# EAGLE design p2-evalboard-v1.0.0 (EAGLE 9.6.2)
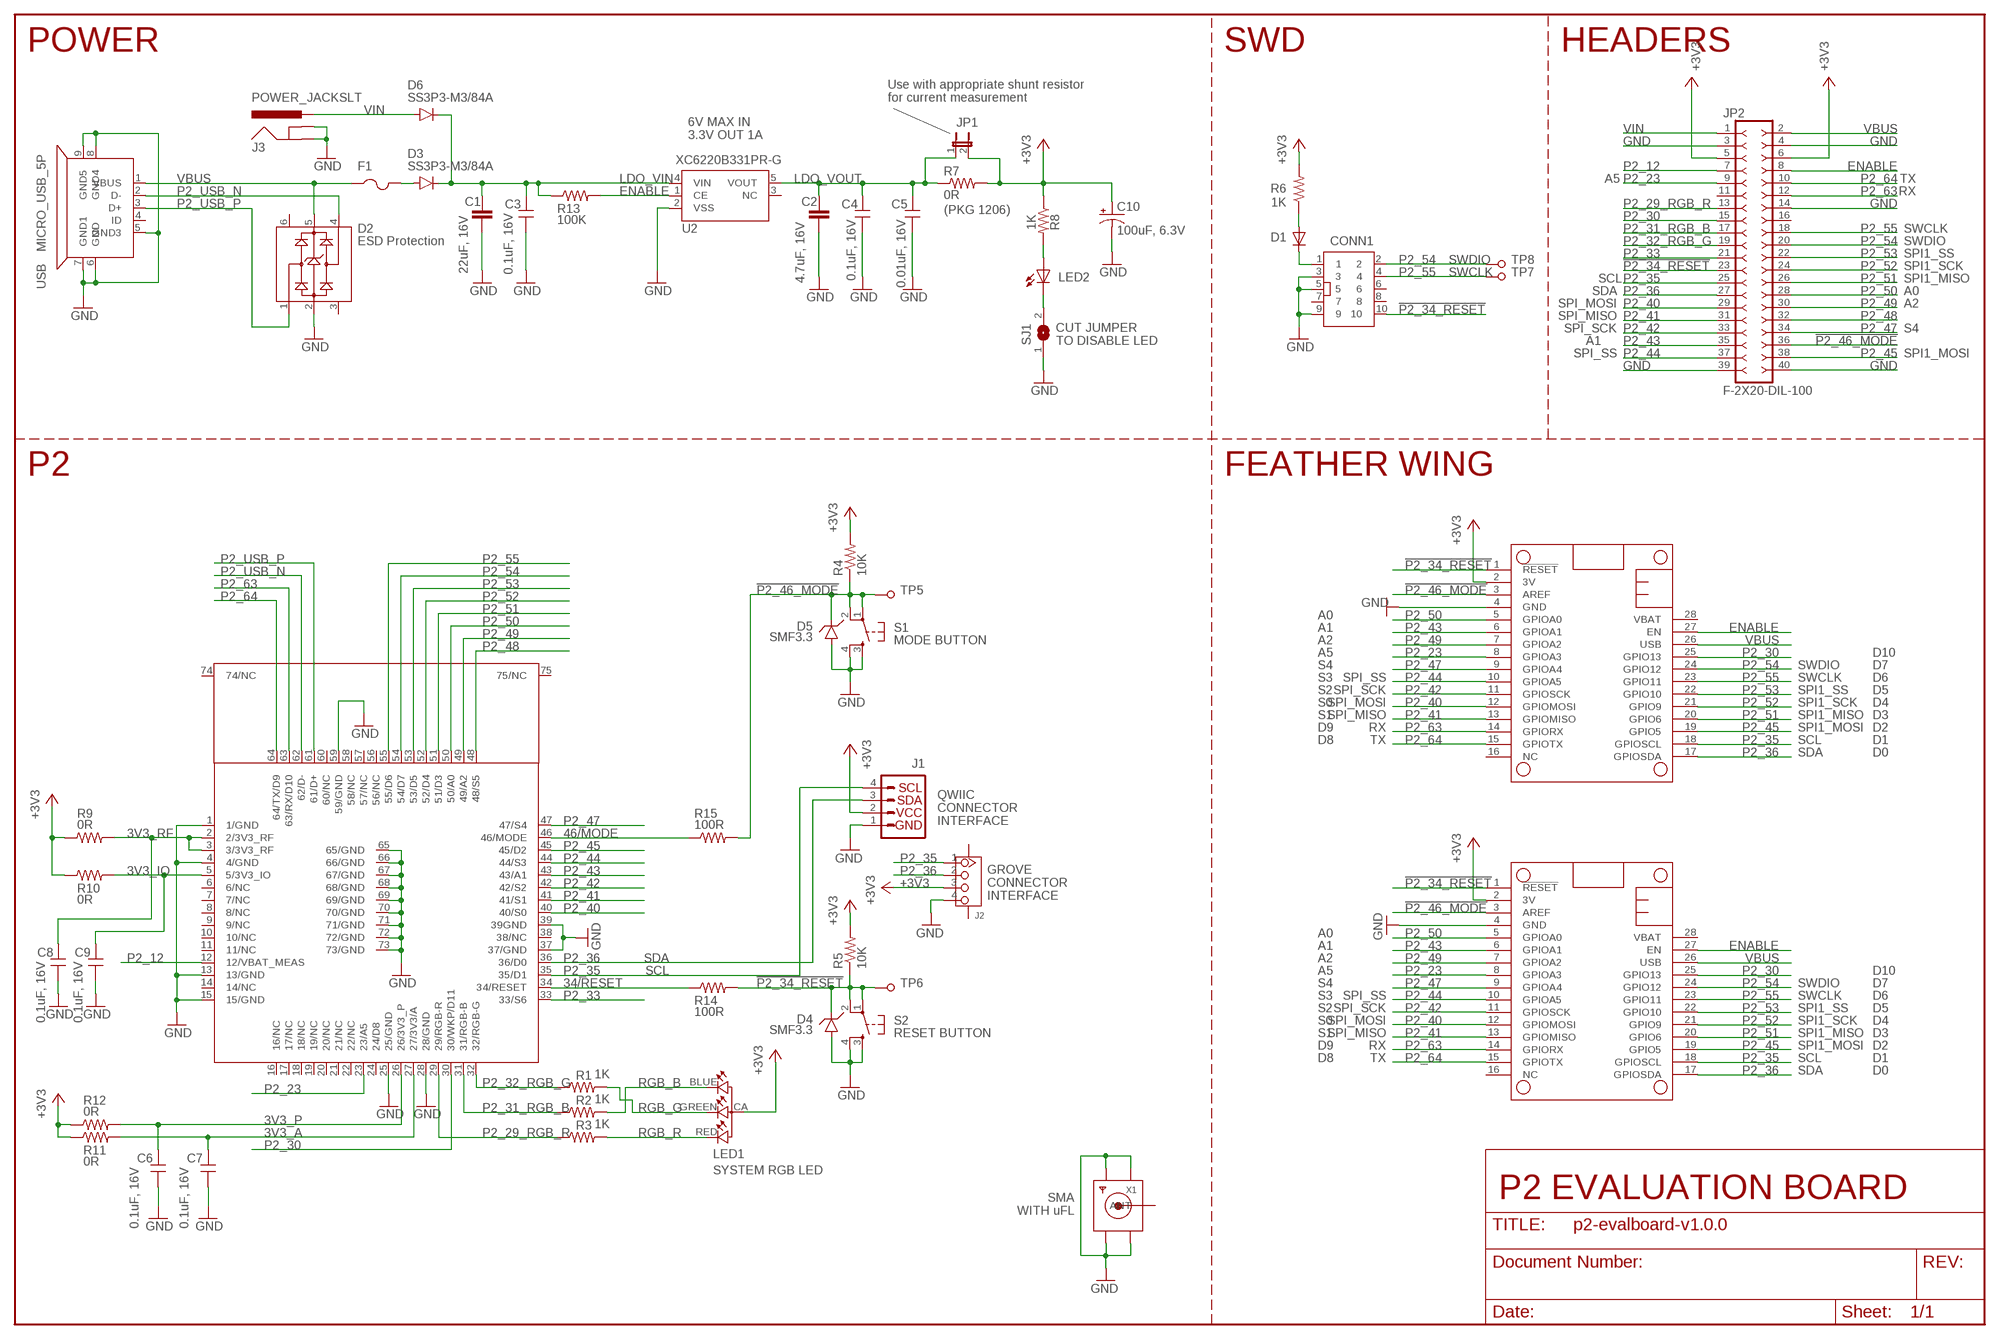
[diagram p0: schematic, sheet 1]

## Parts
C1  22uF, 16V  C-EUC0805  [C0805]
C2  4.7uF, 16V  C-EUC0805  [C0805]
C3  0.1uF, 16V  CAP_0.1UF_16V_0603  [C0603_P]
C4  0.1uF, 16V  CAP_0.1UF_16V_0603  [C0603_P]
C5  0.01uF, 16V  CAP_0.01UF_25V_0603  [C0603_P]
C6  0.1uF, 16V  CAP_0.1UF_16V_0603  [C0603_P]
C7  0.1uF, 16V  CAP_0.1UF_16V_0603  [C0603_P]
C8  0.1uF, 16V  CAP_0.1UF_16V_0603  [C0603_P]
C9  0.1uF, 16V  CAP_0.1UF_16V_0603  [C0603_P]
C10  100uF, 6.3V  CPOL-USC  [PANASONIC_C]
CONN1  CONN5X2  [CONN5X2_1.27]
D1  DIODESOD-323F  [SOD-323F]
D2  MAX3207EAUT+T  [SOT23-6]
D3  SS3P3-M3/84A  DIODE  [DIODE-DO-220AA(SMP)]
D4  SMF3.3  TVS-DIODE-SOD123FL  [SOD-123FL]
D5  SMF3.3  TVS-DIODE-SOD123FL  [SOD-123FL]
D6  SS3P3-M3/84A  DIODE  [DIODE-DO-220AA(SMP)]
F1  PTCFUSE-1206  [R1206]
J1  QWIIC_CONNECTORJS-1MM  [1X04_1MM_RA]
J2  4P-SMD-2.0-90D  GROVE-CONNECTOR-SMD-90D(4+2P-2.0)  [HW4-SMD-2.0-90D]
J3  POWER_JACKSLT  [POWER_JACK_SLOT]
JP1  JUMPER2  [JUMPER2]
JP2  F-2X20-DIL-100  [DIL-100-2X20]
LED1  RGB-LED-CLMVB-FKARGB  [PLCC4-2MM-RGB]
LED2  LEDCHIPLED_0603  [CHIPLED_0603]
MS1  FEATHERWING_NODIM  [FEATHERWING_DIM]
MS2  FEATHERWING_NODIM  [FEATHERWING_DIM]
R1  1K  RES_1K_0603  [R0603_P]
R2  1K  RES_1K_0603  [R0603_P]
R3  1K  RES_1K_0603  [R0603_P]
R4  10K  RES_10K_0603  [R0603_P]
R5  10K  RES_10K_0603  [R0603_P]
R6  1K  RES_1K_0603  [R0603_P]
R7  0R  R-US_R1206  [R1206]
R8  1K  RES_1K_0603  [R0603_P]
R9  0R  RES_0R_0603  [R0603_P]
R10  0R  RES_0R_0603  [R0603_P]
R11  0R  RES_0R_0603  [R0603_P]
R12  0R  RES_0R_0603  [R0603_P]
R13  100K  RES_100K_0603  [R0603_P]
R14  100R  RES_0603  [R0603_P]
R15  100R  RES_0603  [R0603_P]
S1  TAC_SWITCHSMD  [TACTILE_SWITCH_SMD]
S2  TAC_SWITCHSMD  [TACTILE_SWITCH_SMD]
SJ1  SOLDERJUMPERCLOSED  [SOLDERJUMPER_CLOSEDWIRE]
TP5  TP-1.5MM  [TP]
TP6  TP-1.5MM  [TP]
TP7  TP-1.5MM  [TP]
TP8  TP-1.5MM  [TP]
U1  P2  [TRON]
U2  XC6220B331PR-G  XC6220B331PR-GSOT-89-5_TOR-M  [SOT-89-5_TOR-M]
USB  MICRO_USB_5P  MICRO_USBMICRO_USB  [MICRO_USB]
X1  SMACONNECTOR  [SMA90_DIP]

## Nets
3V3_A: C7.2 R11.2 U1.27(27/3V3/A)
3V3_IO: C9.2 R10.2 U1.5(5/3V3_IO)
3V3_P: C6.2 R12.2 U1.26(26/3V3_P)
3V3_RF: C8.2 R9.2 U1.2(2/3V3_RF) U1.3(3/3V3_RF)
34/RESET: R14.1 U1.34(34/RESET)
46/MODE: R15.1 U1.46(46/MODE)
!P2_34_RESET: CONN1.10 D4.C JP2.23 MS1.1(!RESET) MS2.1(!RESET) R5.1 R14.2 S2.1 S2.2 TP6.TP
!P2_46_MODE: D5.C JP2.36 MS1.3(AREF) MS2.3(AREF) R4.1 R15.2 S1.1 S1.2 TP5.TP
+3V3: C10.+ J1.2(VCC) J2.3 JP1.2 JP2.5 JP2.6 LED1.CA MS1.2(3V) MS2.2(3V) R4.2 R5.2 R6.2 R7.2 R8.1 R9.1 R10.1 R11.1 R12.1
ENABLE: JP2.8 MS1.27(EN) MS2.27(EN) R13.2 U2.1(CE)
GND: C1.2 C2.2 C3.1 C4.1 C5.1 C6.1 C7.1 C8.1 C9.1 C10.- CONN1.3 CONN1.5 CONN1.9 D2.2 D4.A D5.A J1.1(GND) J2.4 J3.GND@1(GNDBREAK) J3.GND@2(GND) JP2.3 JP2.4 JP2.14 JP2.39 JP2.40 MS1.4(GND) MS2.4(GND) S1.3 S1.4 S2.3 S2.4 SJ1.1 U1.1(1/GND) U1.4(4/GND) U1.13(13/GND) U1.15(15/GND) U1.25(25/GND) U1.28(28/GND) U1.37(37/GND) U1.39(39GND) U1.59(59/GND) U1.65(65/GND) U1.66(66/GND) U1.67(67/GND) U1.68(68/GND) U1.69(69/GND) U1.70(70/GND) U1.71(71/GND) U1.72(72/GND) U1.73(73/GND) U2.2(VSS) USB.5(GND3) USB.6(GND) USB.7(GND1) USB.8(GND4) USB.9(GND5) X1.GND1 X1.GND2 X1.GND3 X1.GND4
LDO_VIN: C1.1 C3.2 D3.CATHODE D6.CATHODE R13.1 U2.4(VIN)
LDO_VOUT: C2.1 C4.2 C5.2 JP1.1 R7.1 U2.5(VOUT)
N$17: CONN1.1 D1.C
N$18: D1.A R6.1
N$28: LED2.C SJ1.2
N$29: D3.ANODE F1.2
N$31: LED2.A R8.2
P2_12: JP2.7 U1.12(12/VBAT_MEAS)
P2_23: JP2.9 MS1.8(GPIOA3) MS2.8(GPIOA3) U1.23(23/A5)
P2_29_RGB_R: JP2.13 R3.1 U1.29(29/RGB-R)
P2_30: JP2.15 MS1.25(GPIO13) MS2.25(GPIO13) U1.30(30/WKP/D11)
P2_31_RGB_B: JP2.17 R2.1 U1.31(31/RGB-B)
P2_32_RGB_G: JP2.19 R1.1 U1.32(32/RGB-G)
P2_33: JP2.21 U1.33(33/S6)
P2_35: J1.4(SCL) J2.1 JP2.25 MS1.18(GPIOSCL) MS2.18(GPIOSCL) U1.35(35/D1)
P2_36: J1.3(SDA) J2.2 JP2.27 MS1.17(GPIOSDA) MS2.17(GPIOSDA) U1.36(36/D0)
P2_40: JP2.29 MS1.12(GPIOMOSI) MS2.12(GPIOMOSI) U1.40(40/S0)
P2_41: JP2.31 MS1.13(GPIOMISO) MS2.13(GPIOMISO) U1.41(41/S1)
P2_42: JP2.33 MS1.11(GPIOSCK) MS2.11(GPIOSCK) U1.42(42/S2)
P2_43: JP2.35 MS1.6(GPIOA1) MS2.6(GPIOA1) U1.43(43/A1)
P2_44: JP2.37 MS1.10(GPIOA5) MS2.10(GPIOA5) U1.44(44/S3)
P2_45: JP2.38 MS1.19(GPIO5) MS2.19(GPIO5) U1.45(45/D2)
P2_47: JP2.34 MS1.9(GPIOA4) MS2.9(GPIOA4) U1.47(47/S4)
P2_48: JP2.32 U1.48(48/S5)
P2_49: JP2.30 MS1.7(GPIOA2) MS2.7(GPIOA2) U1.49(49/A2)
P2_50: JP2.28 MS1.5(GPIOA0) MS2.5(GPIOA0) U1.50(50/A0)
P2_51: JP2.26 MS1.20(GPIO6) MS2.20(GPIO6) U1.51(51/D3)
P2_52: JP2.24 MS1.21(GPIO9) MS2.21(GPIO9) U1.52(52/D4)
P2_53: JP2.22 MS1.22(GPIO10) MS2.22(GPIO10) U1.53(53/D5)
P2_54: CONN1.2 JP2.20 MS1.24(GPIO12) MS2.24(GPIO12) TP8.TP U1.54(54/D7)
P2_55: CONN1.4 JP2.18 MS1.23(GPIO11) MS2.23(GPIO11) TP7.TP U1.55(55/D6)
P2_63: JP2.12 MS1.14(GPIORX) MS2.14(GPIORX) U1.63(63/RX/D10)
P2_64: JP2.10 MS1.15(GPIOTX) MS2.15(GPIOTX) U1.64(64/TX/D9)
P2_USB_N [diff pair]: D2.4 U1.62(62/D-) USB.2(D-)
P2_USB_P [diff pair]: D2.1 U1.61(61/D+) USB.3(D+)
RGB_B: LED1.BLUE R2.2
RGB_G: LED1.GREEN R1.2
RGB_R: LED1.RED R3.2
VBUS: D2.5 F1.1 JP2.2 MS1.26(USB) MS2.26(USB) USB.1(VBUS)
VIN: D6.ANODE J3.PWR JP2.1
Unconnected: CONN1.6 CONN1.7 CONN1.8 D2.3 D2.6 J2.SS1 J2.SS2 JP2.11 JP2.16 MS1.16(NC) MS1.28(VBAT) MS2.16(NC) MS2.28(VBAT) U1.6(6/NC) U1.7(7/NC) U1.8(8/NC) U1.9(9/NC) U1.10(10/NC) U1.11(11/NC) U1.14(14/NC) U1.16(16/NC) U1.17(17/NC) U1.18(18/NC) U1.19(19/NC) U1.20(20/NC) U1.21(21/NC) U1.22(22/NC) U1.24(24/D8) U1.38(38/NC) U1.56(56/NC) U1.57(57/NC) U1.58(58/NC) U1.60(60/NC) U1.74(74/NC) U1.75(75/NC) U2.3(NC) USB.4(ID) X1.ANTENNA(ANT)

## Notes on the sheet
- POWER | SWD | HEADERS
- Use with appropriate shunt resistor 
  for current measurement
- 6V MAX IN
  3.3V OUT 1A
- A5 | TX
- RX
- (PKG 1206)
- SWCLK
- ESD Protection | SWDIO
- SPI1_SS
- SWDIO
- SPI1_SCK
- SWCLK
- SCL | SPI1_MISO
- SDA | A0
- SPI_MOSI | A2
- SPI_MISO
- SPI_SCK | S4
- CUT JUMPER 
  TO DISABLE LED
- A1
- SPI_SS | SPI1_MOSI
- P2 | FEATHER WING
- A0
- A1
- MODE BUTTON | A2
- A5 | D10
- S4 | SWDIO | D7
- S3 | SPI_SS | SWCLK | D6
- S2 | SPI_SCK | SPI1_SS | D5
- S0 | SPI_MOSI | SPI1_SCK | D4
- S1 | SPI_MISO | SPI1_MISO | D3
- D9 | RX | SPI1_MOSI | D2
- D8 | TX | SCL | D1
- SDA | D0
- QWIIC
  CONNECTOR
  INTERFACE
- GROVE
  CONNECTOR
  INTERFACE
- A0
- A1
- SDA | A2
- SCL | A5 | D10
- S4 | SWDIO | D7
- S3 | SPI_SS | SWCLK | D6
- S2 | SPI_SCK | SPI1_SS | D5
- S0 | SPI_MOSI | SPI1_SCK | D4
- RESET BUTTON | S1 | SPI_MISO | SPI1_MISO | D3
- D9 | RX | SPI1_MOSI | D2
- D8 | TX | SCL | D1
- SDA | D0
- SYSTEM RGB LED
- SMA
  WITH uFL
- P2 EVALUATION BOARD

## Library data of the parts
C1 C2 = rcl:C-EU: CAPACITOR, European symbol; SPICEPREFIX: C
C3 C4 C6-C9 = particle-studios:CAP_: Particle Capacitors; DESP: CAP CER 0.1UF 16V X7R 0603; MFG: FENGHUA; MPN: 0603B104K160NT; PPN: PT-200082
C5 = particle-studios:CAP_: Particle Capacitors; DESP: CAP CER 0.01UF 16V X7R 0603; MFG: YAGEO; MPN: CC0603KRX7R9BB103; PPN: PT-200456
C10 = rcl:CPOL-US: POLARIZED CAPACITOR, American symbol; SPICEPREFIX: C
CONN1 = particle-studios:CONN5X2: 5x2 pin JTAG connector for Particle mesh dev kits
D1 = particle-studios:DIODE: Diode SMADIODE - SMA Surface Mount Package 20V 1A Schottky Diode Digikey: 641-1014-6-ND DO-1N4148 - Through Hole Small Current Diode SOD-123 20V 1 A (.5mV Vf) Schottky Diode - Digikey: MBRX120TPMSCT-ND SOD-323 10V 570mA (.38mV Vf, 3ns) Schottky Diode - Digikey: ZLLS410CT-ND SOD-523 30V 30mA Schottky Diode (RB751S-40TE61) - Digikey: RB751S-40TE61CT-ND SOT23-R/W - SOT23 Package (R = Solder Paste/Reflow Ovens, W = Hand-Soldering) BAT54Film 40V 300mA - Digikey: 497-7162-1-ND
D2 = particle-studios:MAX3207; DESP: TVS DIODE SOT23-6; MFG: MAXIM; MPN: MAX3207EAUT+T; PPN: PC-201321
D3 D6 = Particle:DIODE
D4 D5 = particle-studios:TVS-DIODE-SOD123
F1 = adafruit:PTCFUSE: PTC fuses, resettable thermistors
J1 = SparkFun-Connectors:QWIIC_CONNECTOR: SparkFun I2C Standard Qwiic Connector An SMD 1mm pitch JST connector makes it easy and quick (get it? Qwiic?) to connect I2C devices to each other. The Qwiic system <http://www.sparkfun.com/qwiic> enables fast and solderless connection between popular platforms and various sensors and actuators. We carry 200mm <https://www.sparkfun.com/products/14204>, 100mm <https://www.sparkfun.com/products/14205>, 50mm <https://www.sparkfun.com/products/14206>, and breadboard friendly <https://www.sparkfun.com/products/14207> Qwiic cables. We also offer 10 pcs strips <https://www.sparkfun.com/products/14323> the SMD connectors.
J2 = Seeed-Connector:GROVE-CONNECTOR-SMD-90D(4+2P-2.0): 320110032
J3 = Particle:POWER_JACK: Power Jack This is the standard 5.5mm barrel jack for power. The PTH is the most common, proven, reliable, footprint. The Slot footprint only works if the mill layer is transmitted to the PCB fab house so be warned. Spark Fun Electronics SKU : PRT-00119 SMT: CONN-08106 Mating wall wart : TOL-00298 (and others)
JP1 = microbuilder:JUMPER2: JUMPER - 2 Pins
JP2 = con-headers-jp:F-2X20-: FEMALE HEADER
LED1 = particle-studios:RGB-LED-CLMVB-FKA: CREE CLMVB-FKA RGB LED 2mm x 2mm
LED2 = adafruit:LED: LED OSRAM: - CHIPLED LG R971, LG N971, LY N971, LG Q971, LY Q971, LO R971, LY R971 LH N974, LH R974 LS Q976, LO Q976, LY Q976 LO Q996 - Hyper CHIPLED LW Q18S LB Q993, LB Q99A, LB R99A - SideLED LS A670, LO A670, LY A670, LG A670, LP A670 LB A673, LV A673, LT A673, LW A673 LH A674 LY A675 LS A676, LA A676, LO A676, LY A676, LW A676 LS A679, LY A679, LG A679 - Hyper Micro SIDELED® LS Y876, LA Y876, LO Y876, LY Y876 LT Y87S - SmartLED LW L88C, LW L88S LB L89C, LB L89S, LG L890 LS L89K, LO L89K, LY L89K LS L896, LA L896, LO L896, LY L896 - TOPLED LS T670, LO T670, LY T670, LG T670, LP T670 LSG T670, LSP T670, LSY T670, LOP T670, LYG T670 LG T671, LOG T671, LSG T671 LB T673, LV T673, LT T673, LW T673 LH T674 LS T676, LA T676, LO T676, LY T676, LB T676, LH T676, LSB T676, LW T676 LB T67C, LV T67C, LT T67C, LS T67K, LO T67K, LY T67K, LW E67C LS E67B, LA E67B, LO E67B, LY E67B, LB E67C, LV E67C, LT E67C LW T67C LS T679, LY T679, LG T679 LS T770, LO T770, LY T770, LG T770, LP T770 LB T773, LV T773, LT T773, LW T773 LH T774 LS E675, LA E675, LY E675, LS T675 LS T776, LA T776, LO T776, LY T776, LB T776 LHGB T686 LT T68C, LB T68C - Hyper Mini TOPLED® LB M676 - Mini TOPLED Santana® LG M470 LS M47K, LO M47K, LY M47K Source: http://www.osram.convergy.de/
MS1 MS2 = adafruit:FEATHERWING
R1-R3 R6 R8 = particle-studios:RES_: Particle Resistors; DESP: RES SMD 1K OHM 1% 1/10W 0603; MFG: FENGHUA; MPN: RC-03K102FT; PPN: PT-200135
R4 R5 = particle-studios:RES_: Particle Resistors; DESP: RES SMD 10K OHM 1% 1/10W 0603; MFG: YAGEO; MPN: RC0603FR-0710KL; PPN: PT-200477
R7 = rcl:R-US_: RESISTOR, American symbol; SPICEPREFIX: R
R9-R12 = particle-studios:RES_: Particle Resistors; DESP: RES SMD 0R OHM JUMPER 1/10W 0603; MFG: UMC; MPN: RC0603JR-070RL; PPN: PT-200478
R13 = particle-studios:RES_: Particle Resistors; DESP: RES SMD 100K OHM 1% 1/10W 0603
R14 R15 = particle-studios:RES_: Particle Resistors
S1 S2 = particle-studios:TAC_SWITCH: SMD Tactiile Switch
SJ1 = microbuilder:SOLDERJUMPER: SMD Solder JUMPER Solder the two pads together to create a connection, or remove the solder to break it. REFLOW - Use this footprint for solder paste and reflow ovens. WAVE - Use this footprint for hand-soldering (larger pads). CLOSED - Has a trace between the two pads to ensure it is closed by default. The trace needs to be cut to disable the jumper, and can be closed again by creating a solder bridge between the two pads.
TP5-TP8 = particle-studios:TP-1.5MM
U1 = particle-studios:P2
U2 = particle-studios:XC6220B331PR-G; COPYRIGHT: Copyright (C) 2022 Ultra Librarian. All rights reserved.; DIGI-KEY_PART_NUMBER_1: 893-1128-1-ND; DIGI-KEY_PART_NUMBER_2: 893-1128-2-ND; DIGI-KEY_PART_NUMBER_3: 893-1128-2-NDL; DIGI-KEY_PART_NUMBER_4: 893-1128-6-ND; MANUFACTURER_PART_NUMBER: XC6220B331PR-G; MFR_NAME: Torex Semiconductor
USB = RedBear:MICRO_USB: Micro-USB
X1 = adafruit:SMACONNECTOR: SMA Connector 90° DIP SMA Connector, 50 Ohm (4UConnector: 07259)

## Net classes
1 diff pair: width 0.483 mm, drill 0.3 mm, clearance 0.152 mm

## Board
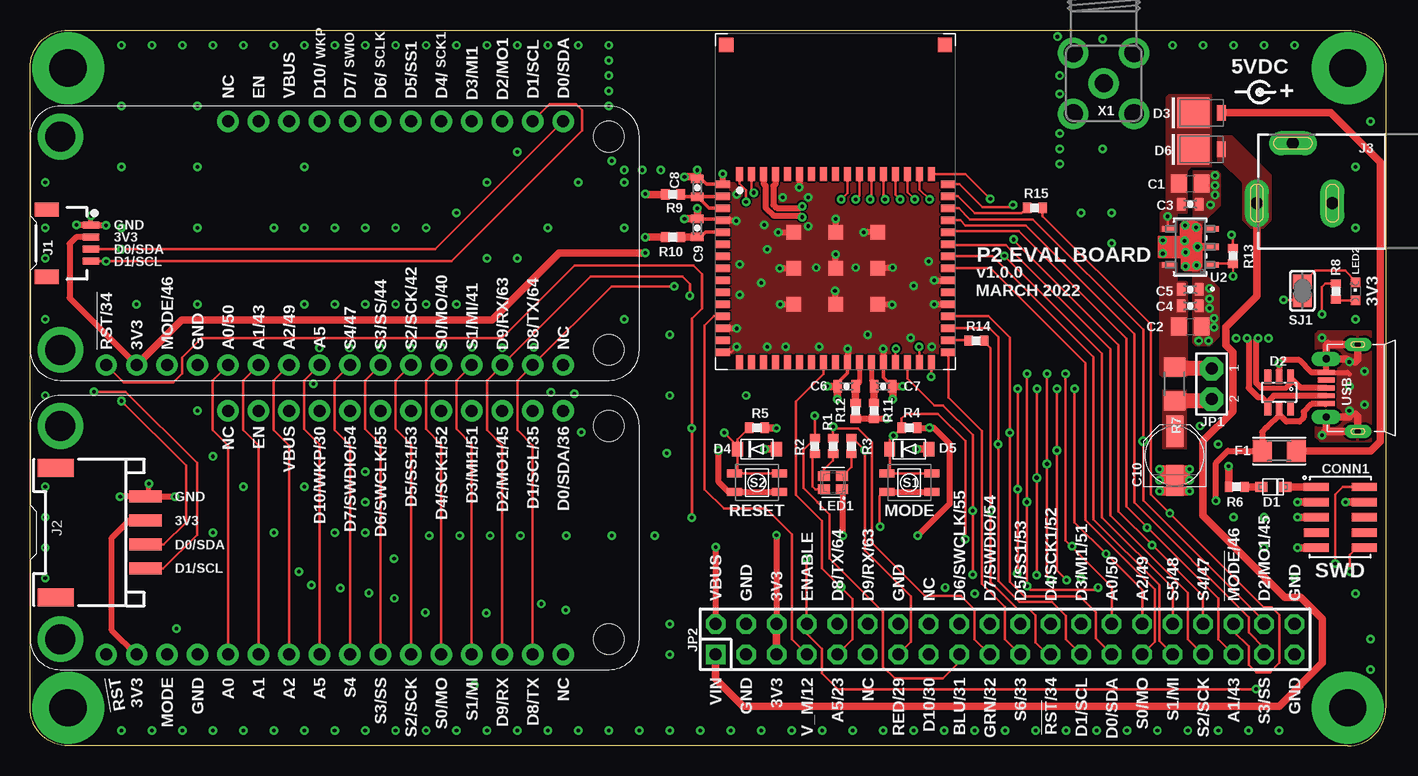
[diagram p1: board, top side]
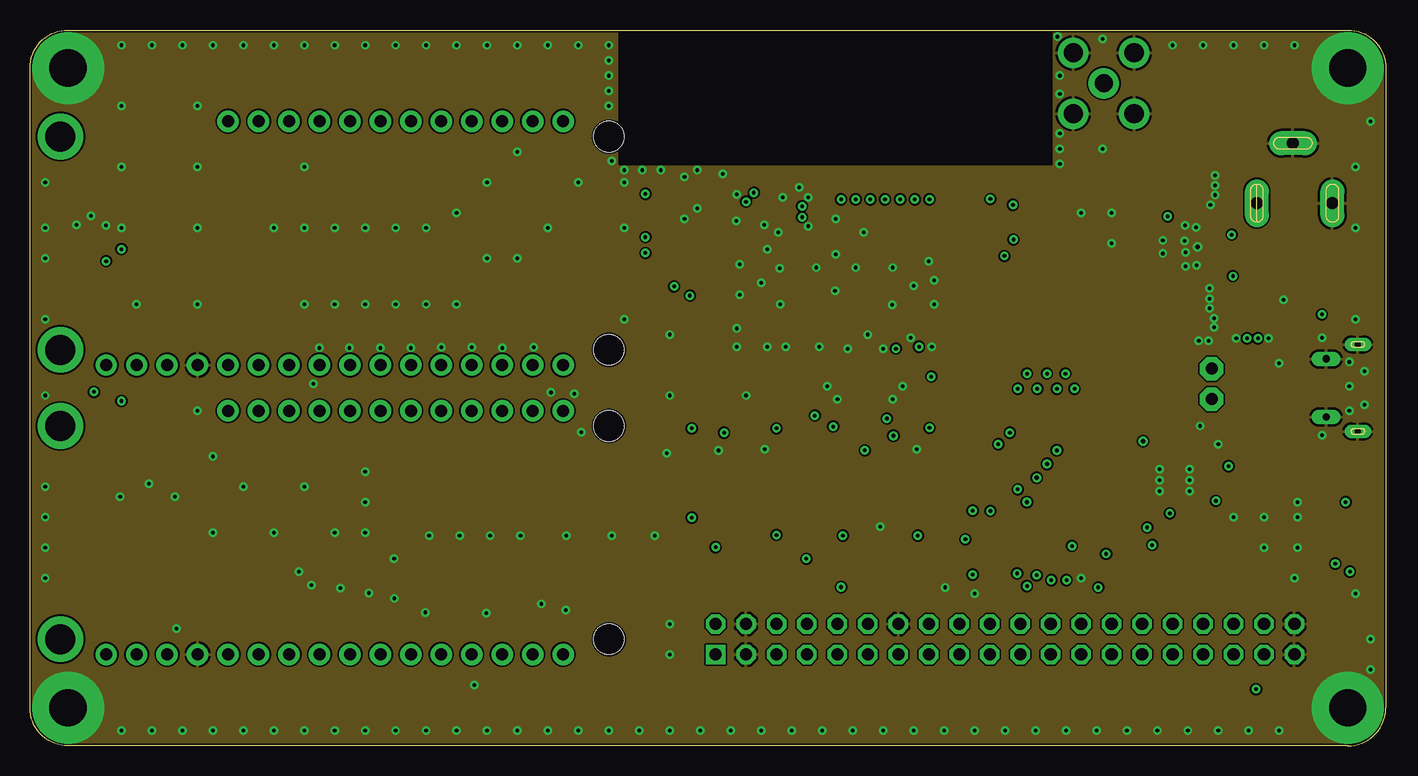
[diagram p2: board, inner layer Route2]
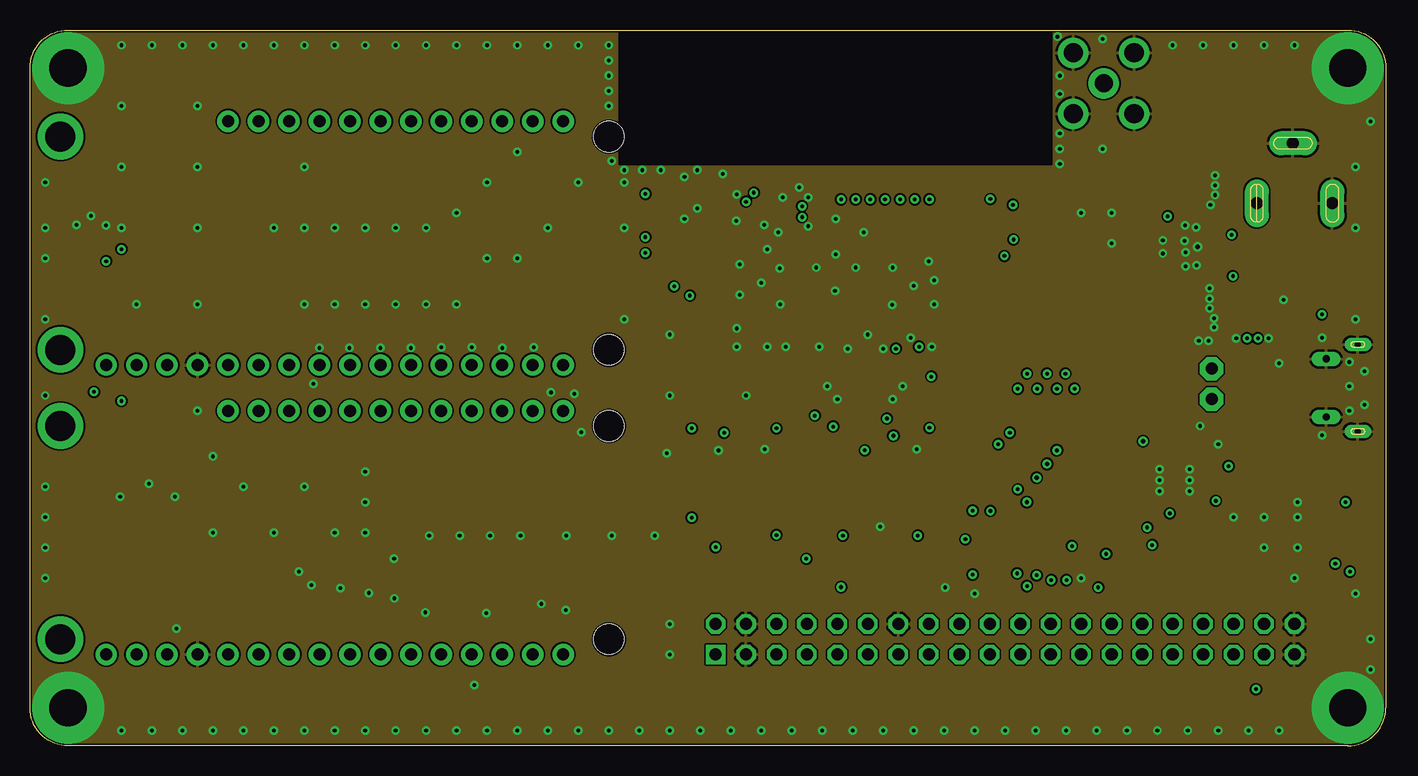
[diagram p3: board, inner layer Route15]
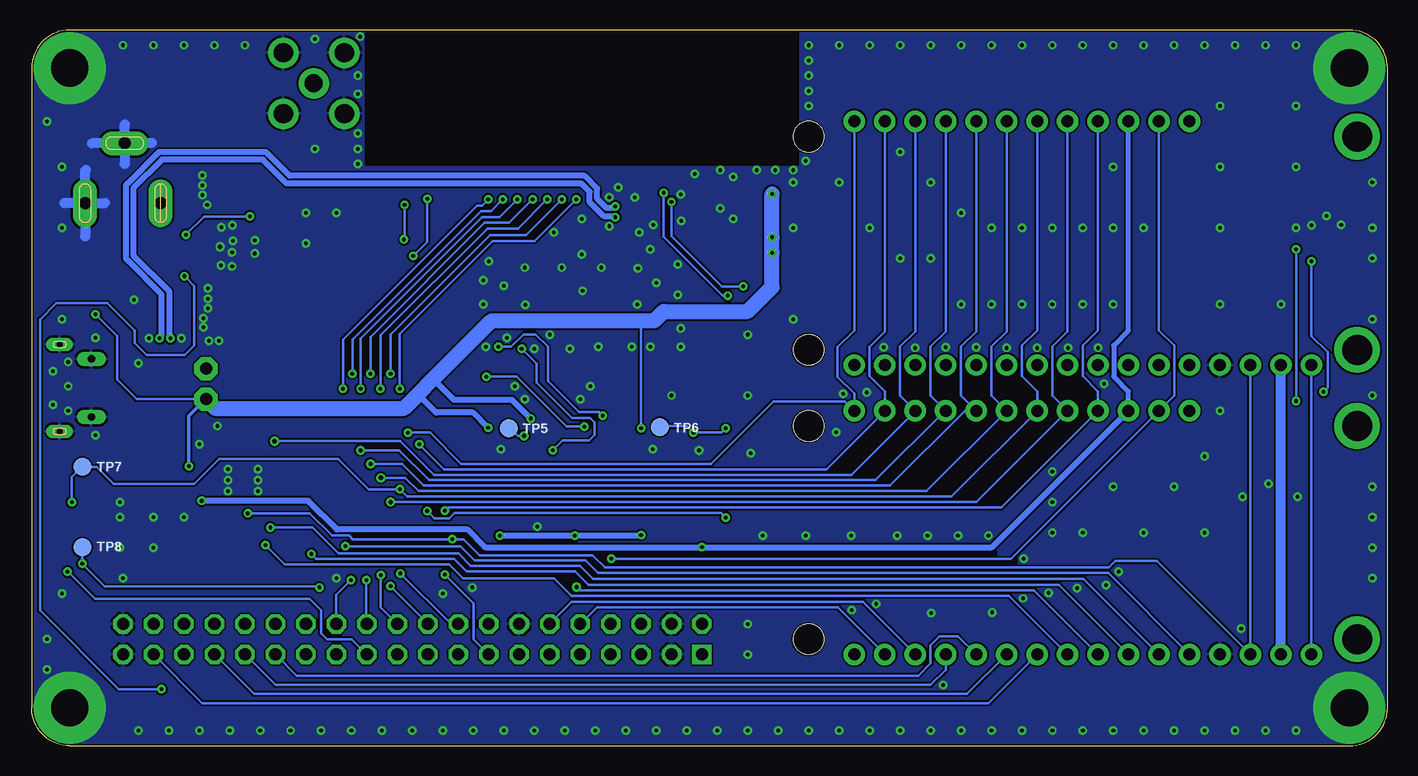
[diagram p4: board, bottom side, seen from below]

Size 113.03 x 59.69 mm. Coordinates in mm from the lower left corner, seen from the top.
Outline: 0,3.17 0,56.52 arc-90 3.17,59.69 109.86,59.69 arc-90 113.03,56.52 113.03,3.17 arc-90 109.86,0 3.17,0 arc-90 0,3.17
Copper layers (1+2*15+16): Top 0.018mm / dielectric 0.195mm / Route2 0.035mm / dielectric 1.1mm / Route15 0.035mm / dielectric 0.195mm / Bottom 0.018mm
Design rules "particle-4layer": minimum track width 6mil, minimum drill 0.3mm, track to track 6mil, track to pad 6mil, pad to pad 6mil, via to via 6mil, smd to smd 0mil, copper to edge 6mil, drill to drill 6mil, minimum pad ring 12mil, minimum via ring 8mil, stop-mask expansion 0mil, vias tented up to drill 20mil, thermal gap 8mil
bRestrict: 2 lines

### Footprints (pad centres in the part's own frame; a part is rotated, then mirrored left to right if it is on the bottom)
C0805 = smd 1.3 x 1.5: 1 -0.95,0; 2 0.95,0
C0603_P = smd 0.711 x 1.041: 1 -0.749,0; 2 0.749,0
PANASONIC_C = smd 2.6 x 1.4: + 2.05,0; - -2.05,0
CONN5X2_1.27 = smd 0.7 x 2.1: 1 -2.54,-2; 2 -2.54,2; 3 -1.27,-2; 4 -1.27,2; 5 0,-2; 6 0,2; 7 1.27,-2; 8 1.27,2; 9 2.54,-2; 10 2.54,2
SOD-323F = smd 1 x 0.8: A -1,0; C 1,0
SOT23-6 = smd 0.55 x 1.2: 1 -0.95,-1.3; 2 0,-1.3; 3 0.95,-1.3; 4 0.95,1.3; 5 0,1.3; 6 -0.95,1.3
DIODE-DO-220AA(SMP) = smd 0.762 x 1.27: ANODE 2.349,0 | smd 2.667 x 2.54: CATHODE 0,0
SOD-123FL = smd 0.91 x 1.22: A 1.637,0; C -1.637,0
R1206 = smd 1.6 x 1.803: 1 -1.422,0; 2 1.422,0
1X04_1MM_RA = smd 0.6 x 1.35: 1 -1.5,0; 2 -0.5,0; 3 0.5,0; 4 1.5,0 | smd 1.2 x 2: NC1 2.8,-3.675; NC2 -2.8,-3.675
HW4-SMD-2.0-90D = smd 1.01 x 2.74: 1 -3,-0.1; 2 -1,-0.1; 3 1,-0.1; 4 3,-0.1 | smd 1.5 x 3: SS1 -5.4,7.4; SS2 5.4,7.4
POWER_JACK_SLOT = drill 1 pad 2 long: GND@1 2.58,7.5; GND@2 7.58,10.8; PWR 2.58,13.8
JUMPER2 = drill 1 pad 1.93 octagon: 1 2.54,0; 2 0,0
DIL-100-2X20 = drill 1.016 square: 1 -24.13,-1.27 | drill 1.016 octagon: 2 -24.13,1.27; 3 -21.59,-1.27; 4 -21.59,1.27; 5 -19.05,-1.27; 6 -19.05,1.27; 7 -16.51,-1.27; 8 -16.51,1.27; 9 -13.97,-1.27; 10 -13.97,1.27; 11 -11.43,-1.27; 12 -11.43,1.27; 13 -8.89,-1.27; 14 -8.89,1.27; 15 -6.35,-1.27; 16 -6.35,1.27; 17 -3.81,-1.27; 18 -3.81,1.27; 19 -1.27,-1.27; 20 -1.27,1.27; 21 1.27,-1.27; 22 1.27,1.27; 23 3.81,-1.27; 24 3.81,1.27; 25 6.35,-1.27; 26 6.35,1.27; 27 8.89,-1.27; 28 8.89,1.27; 29 11.43,-1.27; 30 11.43,1.27; 31 13.97,-1.27; 32 13.97,1.27; 33 16.51,-1.27; 34 16.51,1.27; 35 19.05,-1.27; 36 19.05,1.27; 37 21.59,-1.27; 38 21.59,1.27; 39 24.13,-1.27; 40 24.13,1.27
PLCC4-2MM-RGB = smd 1 x 0.8: BLUE -0.75,-0.55; CA 0.75,-0.55; GREEN -0.75,0.55; RED 0.75,0.55
CHIPLED_0603 = smd 0.8 x 0.8: A 0,-0.75; C 0,0.75
FEATHERWING_DIM = drill 1 pad 1.778: 1 6.35,1.27; 2 8.89,1.27; 3 11.43,1.27; 4 13.97,1.27; 5 16.51,1.27; 6 19.05,1.27; 7 21.59,1.27; 8 24.13,1.27; 9 26.67,1.27; 10 29.21,1.27; 11 31.75,1.27; 12 34.29,1.27; 13 36.83,1.27; 14 39.37,1.27; 15 41.91,1.27; 16 44.45,1.27; 17 44.45,21.59; 18 41.91,21.59; 19 39.37,21.59; 20 36.83,21.59; 21 34.29,21.59; 22 31.75,21.59; 23 29.21,21.59; 24 26.67,21.59; 25 24.13,21.59; 26 21.59,21.59; 27 19.05,21.59; 28 16.51,21.59 | drill 2.5 pad 3.81: P$1 2.54,20.32; P$2 2.54,2.54 | hole 2.54: 48.26,20.32; 48.26,2.54
R0603_P = smd 0.7 x 0.85: 1 -0.65,0; 2 0.65,0
TACTILE_SWITCH_SMD = smd 1.25 x 0.65: 1 -1.875,0.775; 2 1.875,0.775; 3 -1.875,-0.775; 4 1.875,-0.775
SOLDERJUMPER_CLOSEDWIRE = smd 1.168 x 1.6: 1 -0.762,0; 2 0.762,0 | smd 0.635 x 0.203: WIRE 0,0
TP = smd 1.5 x 1.5: TP 0,0
TRON = smd 1.2 x 0.6: 1 0.6,15.45; 2 0.6,14.45; 3 0.6,13.45; 4 0.6,12.45; 5 0.6,11.45; 6 0.6,10.45; 7 0.6,9.45; 8 0.6,8.45; 9 0.6,7.45; 10 0.6,6.45; 11 0.6,5.45; 12 0.6,4.45; 13 0.6,3.45; 14 0.6,2.45; 15 0.6,1.45; 33 19.4,1.45; 34 19.4,2.45; 35 19.4,3.45; 36 19.4,4.45; 37 19.4,5.45; 38 19.4,6.45; 39 19.4,7.45; 40 19.4,8.45; 41 19.4,9.45; 42 19.4,10.45; 43 19.4,11.45; 44 19.4,12.45; 45 19.4,13.45; 46 19.4,14.45; 47 19.4,15.45 | smd 0.6 x 1.2: 16 2,0.6; 17 3,0.6; 18 4,0.6; 19 5,0.6; 20 6,0.6; 21 7,0.6; 22 8,0.6; 23 9,0.6; 24 10,0.6; 25 11,0.6; 26 12,0.6; 27 13,0.6; 28 14,0.6; 29 15,0.6; 30 16,0.6; 31 17,0.6; 32 18,0.6; 48 18,16.3; 49 17,16.3; 50 16,16.3; 51 15,16.3; 52 14,16.3; 53 13,16.3; 54 12,16.3; 55 11,16.3; 56 10,16.3; 57 9,16.3; 58 8,16.3; 59 7,16.3; 60 6,16.3; 61 5,16.3; 62 4,16.3; 63 3,16.3; 64 2,16.3 | smd 1.2 x 1.2: 65 6.5,11.45; 66 6.5,8.45; 67 6.5,5.45; 68 10,11.45; 69 10,8.45; 70 10,5.45; 71 13.5,11.45; 72 13.5,8.45; 73 13.5,5.45; 74 19.12,27.07; 75 0.88,27.07
SOT-89-5_TOR-M = smd 0.483 x 1.118: 1 -1.5,-1.803; 3 1.5,-1.803; 4 1.5,1.803; 5 -1.5,1.803 | smd 0.533 x 1.118: 2 0,-1.803
MICRO_USB = smd 0.4 x 1.4: 1 1.3,0.1; 2 0.65,0.1; 3 0,0.1; 4 -0.65,0.1; 5 -1.3,0.1 | drill 0.6 pad 0.75 long: 6 2.425,0.1 | drill 0.5 pad 1 long: 7 3.625,2.75; 8 -3.625,2.75 | drill 0.6 pad 0.65 long: 9 -2.425,0.1
SMA90_DIP = drill 1.5 pad 2.54: ANTENNA 0,0 | drill 1.6 pad 2.54: GND1 -2.54,2.54; GND2 2.54,2.54; GND3 -2.54,-2.54; GND4 2.54,-2.54

### Placement (x,y rotation side)
C1  96.72,46.89 0 top
C2  96.72,34.95 0 top
C3  96.72,45.16 180 top
C4  96.72,36.68 180 top
C5  96.72,38.05 180 top
C6  68.07,29.97 0 top
C7  71.12,29.97 180 top
C8  55.63,46.53 270 top
C9  55.63,43.18 270 top
C10  95.43,24.19 90 top
CONN1  109.22,19.05 270 top
D1  103.63,21.59 0 top
D2  104.14,29.46 180 top
D3  96.98,52.78 0 top
D4  60.6,24.74 0 top
D5  73.3,24.74 0 top
D6  96.98,49.73 0 top
F1  104.14,24.59 0 top
J1  5.08,41.91 270 top
J2  9.53,17.78 90 top
J3  116.08,42.67 90 top
JP1  98.5,28.91 90 top
JP2  81.28,8.89 0 top
LED1  66.95,21.95 0 top
LED2  110.49,37.9 0 top
MS1  0,6.35 0 top
MS2  0,30.48 0 top
R1  66.95,24.99 270 top
R2  65.43,24.99 270 top
R3  68.48,24.99 270 top
R4  73.3,26.52 0 top
R5  60.6,26.52 0 top
R6  100.58,21.59 180 top
R7  95.4,30.18 270 top
R8  108.86,37.9 270 top
R9  53.59,45.97 0 top
R10  53.59,42.42 0 top
R11  70.36,27.94 90 top
R12  68.83,27.94 90 top
R13  100.28,40.84 270 top
R14  78.89,33.78 0 top
R15  83.77,44.86 0 top
S1  73.3,21.95 0 top
S2  60.6,21.95 0 top
SJ1  106.07,37.95 90 top
TP5  73.25,26.47 0 bottom
TP6  60.66,26.57 0 bottom
TP7  108.81,23.27 0 bottom
TP8  108.81,16.56 0 bottom
U1  57.15,31.37 0 top
U2  96.72,41.61 90 top
USB  107.95,29.84 270 top
X1  89.51,55.24 0 top

### Tracks (layer width: path | path; a pad name or v marks a point on that pad's centre or on a via)
3V3_A
  Top 0.406: U1.27 70.15,30.5 70.37,30.28 C7.2 70.36,29.96
  Top 0.61: R11.2 70.36,29.96
3V3_IO
  Top 0.305: C9.2 55.93,42.43 56.32,42.82 U1.5
  Top 0.508: C9.2 55.61,42.42
  Top 0.61: 55.61,42.42 R10.2
3V3_P
  Top 0.406: U1.26 69.15,30.3 C6.2 | R12.2 68.82,28.6
  Top 0.61: 68.82,28.6 C6.2
3V3_RF
  Top 0.305: U1.2 57.65,45.92 57.51,45.78 C8.2 | U1.3 56.59,44.82 C8.2 | C8.2 54.43,45.78 R9.2
34/RESET
  Top 0.203: U1.34 78.2,33.82 R14.1
46/MODE
  Top 0.203: U1.46 77.37,45.82 78.79,44.4 82.66,44.4 R15.1
!P2_34_RESET  (via drill 0.3)
  Top 0.203: 59.99,26.56 R5.1 58.97,25.53 58.97,25.01 | 58.97,25.01 D4.C 58.97,22.81 58.88,22.72 | S2.1 58.88,22.72 | 58.88,22.72 S2.2 | MS2.1 7.82,30.28 11.94,30.28 12.7,31.04 12.7,32.36 14.33,33.98 39.37,33.98 45.41,40.03 55.32,40.03 56.03,39.32 56.03,36.47 55.17,35.61 v55.17,26.47 v55.17,19.02 | v57.86,26.11 58.97,25.01 | CONN1.10 110.59,16.51 110.02,15.94 110.02,14.54 v110.03,14.53 | JP2.23 84.84,7.62 83.82,8.64 83.82,10.87 83.26,11.43 82.3,11.43 80.06,13.66 v80.06,19.58 80.06,33.17 79.54,33.69 R14.2
  Bottom 0.203: MS1.1 MS2.1 | v55.17,26.47 55.52,26.11 v57.86,26.11 58.42,26.67 60.55,26.67 TP6.TP | JP2.23 86.36,8.89 88.39,8.89 88.9,9.4 88.9,11.28 89.86,12.24 107.75,12.24 v110.03,14.53 | v80.06,19.58 79.43,18.95 78.23,18.95 77.78,19.41 55.55,19.41 v55.17,19.02
!P2_46_MODE  (via drill 0.3, 0.35)
  Top 0.203: S1.1 71.63,22.72 | 71.63,22.72 S1.2 | 71.63,22.72 71.67,22.76 D5.C 71.67,25.53 v71.99,25.85 R4.1 72.65,27.29 73.05,27.69 75.69,27.69 77.98,25.4 v77.98,17.22 | 100.33,10.21 JP2.36 100.33,9.55 101.6,8.28 101.6,6.76 102.21,6.15 103.38,6.15 104.14,6.91 104.14,10.92 103.53,11.53 102.87,11.53 v95.02,19.38 93.42,20.98 93.42,35.15 84.4,44.17 84.4,44.84 R15.2
  Bottom 0.203: MS2.3 MS1.3 19.23,15.42 22.68,15.42 23.24,14.86 65.23,14.86 66.26,15.89 75.68,15.89 77.01,17.22 v77.98,17.22 86.26,17.22 86.56,17.53 87.99,17.53 89.84,19.38 v95.02,19.38 | TP5.TP 73.11,26.47 72.5,25.85 v71.99,25.85
+3V3  (via drill 0.3)
  Top 0.203: 62.18,26.52 v62.23,26.47 | v99.92,23.32 99.93,23.31 | R8.1 107.99,38.55 107.7,38.25 v107.7,35.97
  Top 0.508: MS1.2 8.84,7.62 6.83,9.63 6.83,17.35 8.26,18.78 J2.3 | J1.2 3.85,42.41 3.3,41.86 3.3,37.34 MS2.2 | R12.1 R11.1 v71.44,27.29 | 51.36,45.97 v51.31,46.02 | R4.2 v74.98,26.52 75.34,26.52 76.66,25.2 76.66,20.17 v74.02,17.53 | v67.77,17.53 67.77,21.33 LED1.CA | v62.23,17.58 JP2.6
  Top 0.61: MS2.2 12.65,35.51 38.51,35.51 44.09,41.1 v51.31,41.1 | R5.2 62.18,26.52 | R9.1 51.36,45.97 | R10.1 v51.31,42.42 | 99.93,23.31 R6.2 | JP2.5 JP2.6
  Top 1.27: JP1.2 98.35,28.75 R7.2
  Bottom 0.203: v62.23,26.47 62.23,35.46 | JP1.2 104.29,28.91 105.92,30.53 105.92,34.19 v107.7,35.97
  Bottom 0.305: JP1.2 99.92,27.48 v99.92,23.32
  Bottom 0.508: v71.44,27.29 73,28.85 77.83,28.85 79.55,30.58 | v74.02,17.53 v67.77,17.53 62.28,17.53 v62.23,17.58 | v74.98,26.52 76.25,27.79 79.3,27.79 80.82,29.31
  Bottom 0.813: MS1.2 MS2.2
  Bottom 1.27: JP1.2 97.74,28.14 81.99,28.14 80.82,29.31 79.55,30.58 74.68,35.46 62.23,35.46 61.11,35.46 60.35,36.22 53.34,36.22 51.31,38.25 v51.31,41.1 v51.31,42.42 v51.31,46.02
  pour Top (no thermals): 94.39,24.79 96.42,24.79 96.42,29.62 94.39,29.62
ENABLE  (via drill 0.3)
  Top 0.152: R13.2 v100.28,39.17
  Top 0.203: v64.72,15.6 64.72,10.21 JP2.8 64.77,9.35 66.04,8.08 66.04,6.04 67.36,4.72 v102.21,4.72 | R13.2 98.61,40.19 U2.1
  Bottom 0.203: MS2.27 19.05,34.64 17.78,33.37 17.78,29.21 MS1.27 31.39,15.6 v64.72,15.6 | v102.21,4.72 105.77,4.72 112.32,11.28 112.32,35.56 110.97,36.91 106.73,36.91 104.44,34.62 104.44,33.6 103.43,32.59 100.25,32.59 99.47,33.38 99.47,38.35 v100.28,39.17
GND  (via drill 0.3, 0.35, 3.1 pad 6)
  Top 0.152: v58.93,33.27 58.47,32.82 U1.15
  Top 0.203: S2.3 58.51,21.17 | S1.3 71.17,21.17 70.81,20.81 70.81,18.34 v70.87,18.29 | SJ1.1 v104.5,37.19
  Top 0.305: C8.1 55.94,47.28 56.41,46.82 U1.1 | C9.1 57.64,43.93 U1.4 | U1.25 68.15,31.07 67.32,30.24 C6.1 | U1.28 71.15,30.69 C7.1
  Top 0.406: USB.5 109.83,31.14 109.98,30.99 | J1.1 v5.08,44.2 | J2.4 9.91,21.06 v9.91,21.84
  Top 0.508: U1.13 58.91,34.82 v58.93,34.8 | U1.4 58.85,43.82 v58.88,43.79 | U1.1 v57.75,47.69 v57.76,47.7 | v62.38,42.82 U1.65 | v62.48,39.83 U1.66 | v62.53,36.83 U1.67 | v67.11,37.95 67.11,36.86 U1.70 | U1.69 67.15,40.99 v67.16,41 | v67.16,43.94 v67.15,43.93 U1.68 | U1.71 v69.49,42.82 | v71.93,39.88 71.87,39.82 U1.72 | v71.88,36.78 70.69,36.78 U1.73 | v75.39,36.83 U1.37 | v75.39,38.81 U1.39 | v71.12,33.12 71.15,33.09 U1.28 | v68.17,33.12 68.17,31.99 U1.25 | U1.59 64.14,47.65 v64.14,46.56 | C7.1 71.93,29.91 | C6.1 67.31,29.96 | C9.1 55.61,43.94 | 55.46,47.45 C8.1 | v6.35,43.38 6.32,43.41 J1.1 3.88,43.41 v3.86,43.43 | v12.09,20.78 J2.4 v7.52,20.78 | S2.4 S2.3 58.22,21.17 57.4,21.99 v57.4,24.64 | S1.3 S1.4 | D2.2 v104.14,31.9 104.39,32.16 105.82,32.16 106.83,31.14 USB.5 USB.9
  Top 0.61: C7.1 v72.75,29.97 | 71.93,29.91 v71.93,28.91 | C6.1 v66.45,29.97 | 67.31,29.96 v67.31,28.91 | C9.1 v55.63,44.81 | 55.61,43.94 v54.56,43.94 | v54.56,47.45 55.46,47.45 | v55.63,48.01 C8.1 | D4.A v61.27,24.74 | D5.A v73.91,24.74 | CONN1.3 v105.66,20.32 | CONN1.5 v105.66,19.05 | CONN1.9 v105.66,16.51 | v96.32,41.15 96.32,41.1 97.33,40.08 | 97.38,43.28 96.27,42.16 v96.27,42.11 | U2.2 v97.33,41.6 | 110.49,32 110.7,32.21 USB.8 108.26,33.47 108.2,33.53 108.05,33.37 USB.9 109.72,32.27 v109.98,32 | 108.05,26.26 USB.6 108.06,27.43 109.98,27.43 | 108.05,26.26 107.95,26.16 | 110.49,27.69 110.7,27.48 USB.7 108.09,26.22 108.05,26.26
  Top 0.762: v94.18,23.06 v96.67,23.06 | v94.18,21.23 v96.67,21.23 | v94.18,22.15 v96.67,22.15 95.45,22.15 C10.-
  Top 0.813: v96.32,41.15 v96.32,39.98 97.23,39.98 97.33,40.08 v97.33,41.6 97.33,43.13 97.08,43.38 v96.29,43.38 96.27,43.36 v96.27,42.11
  Bottom 0.813: J3.GND@2 107.99,50.25 108,50.24 | J3.GND@2 105.26,50.27 105.26,51.82 | J3.GND@2 105.24,50.29 103.02,50.29 | J3.GND@2 105.28,48.53 105.26,48.51 | J3.GND@1 106.94,45.25 106.93,45.26 | J3.GND@1 108.58,47.94 108.51,48.01 | J3.GND@1 110.28,45.25 110.29,45.26 | J3.GND@1 108.58,42.49 108.56,42.47
  other vias: 98.7,34.9 98.35,36.47 98.35,38.15 98.35,37.29 98.7,35.66 97.43,33.78 98.4,45.11 98.81,46.74 98.81,45.92 98.81,47.55 98.25,33.78 94.44,41.05 94.44,42.16 64.87,45.75 64.87,43.33 103.25,33.99 100.56,33.99 109.98,29.97 109.98,27.94 107.7,34.04 107.7,25.91 111.25,28.45 111.25,31.24 61.21,43.43 59.18,40.13 59.18,37.59 61.47,33.27 62.99,33.27 65.79,33.27 73.41,34.04 69.85,34.29 62.74,45.72 58.93,45.97 65.53,39.88 68.83,39.88 73.66,38.35 74.93,40.39 61.47,41.4 60.96,38.61 75.18,33.27 7.62,1.27 10.16,1.27 12.7,1.27 15.24,1.27 17.78,1.27 20.32,1.27 22.86,1.27 25.4,1.27 27.94,1.27 30.48,1.27 33.02,1.27 35.56,1.27 38.1,1.27 40.64,1.27 43.18,1.27 45.72,1.27 48.26,1.27 50.8,1.27 53.34,1.27 55.88,1.27 58.42,1.27 60.96,1.27 63.5,1.27 66.04,1.27 68.58,1.27 71.12,1.27 73.66,1.27 76.2,1.27 78.74,1.27 81.28,1.27 83.82,1.27 86.36,1.27 88.9,1.27 91.44,1.27 93.98,1.27 96.52,1.27 99.06,1.27 101.6,1.27 104.14,1.27 7.62,58.42 10.16,58.42 12.7,58.42 15.24,58.42 17.78,58.42 20.32,58.42 22.86,58.42 25.4,58.42 27.94,58.42 30.48,58.42 33.02,58.42 35.56,58.42 38.1,58.42 40.64,58.42 43.18,58.42 45.72,58.42 48.26,58.42 48.26,57.15 48.26,55.88 48.26,54.61 48.26,53.34 105.41,58.42 102.87,58.42 100.33,58.42 97.79,58.42 95.25,58.42 1.27,13.97 1.27,16.51 1.27,19.05 1.27,21.59 1.27,29.21 1.27,35.56 1.27,40.64 1.27,43.18 1.27,46.99 111.76,6.35 111.76,8.89 110.49,12.7 110.49,35.56 110.49,43.18 110.49,48.26 111.76,52.07 87.63,44.45 90.17,41.91 90.17,44.45 100.33,19.05 102.87,19.05 102.87,16.51 105.41,13.97 87.63,13.97 33.27,17.53 35.81,17.53 38.35,17.53 40.89,17.53 44.7,17.53 48.51,17.53 52.07,17.53 7.62,53.34 7.62,48.26 7.62,43.18 13.97,43.18 13.97,48.26 13.97,53.34 13.97,36.83 8.89,36.83 13.97,27.94 15.24,24.13 15.24,17.78 12.19,9.78 3.17,3.17 3.17,56.52 109.86,56.52 109.86,3.17 53.34,10.16 53.34,7.62 59.69,29.21 53.34,29.21 53.34,34.29 49.53,35.56 49.53,43.18 49.53,46.99 45.72,46.99 20.32,43.18 22.86,43.18 25.4,43.18 27.94,43.18 30.48,43.18 33.02,43.18 22.86,48.26 22.86,36.83 25.4,36.83 27.94,36.83 30.48,36.83 33.02,36.83 35.56,36.83 35.56,44.45 38.1,46.99 38.1,40.64 40.64,40.64 40.64,49.53 43.18,43.18 17.78,21.59 20.32,17.78 22.86,21.59 25.4,17.78 27.94,20.32 27.94,17.78 27.94,22.86 48.51,48.77 49.53,48.01 51.05,48.01 52.58,48.01 85.85,48.51 85.85,49.78 85.85,51.05 89.41,58.93 89.41,49.78 53.09,24.38 43.43,29.46 45.97,26.16 78.74,12.7 97.54,26.67 99.06,25.15 85.85,54.36 85.85,55.88 85.65,59.13 97.21,43.23 97.26,40.08 44.65,11.33 42.62,11.84 30.38,12.29 28.24,12.75 23.47,13.41 22.43,14.53 23.62,30.18 45.36,29.36 39.37,33.17 42.01,33.22 36.83,33.22 34.29,33.22 31.75,33.17 29.21,33.17 26.62,33.17 24.13,33.17 32.97,11.13 38.05,11.07 37.03,5.08 30.35,15.62 25.88,13.16 76.3,13.21
  pour Top (no thermals): 97.18,33.32 96.93,33.58 96.93,40.49 97.74,40.49 97.74,39.57 99.11,38.2 99.11,34.09 98.35,33.32
  pour Top (no thermals): 96.98,42.72 96.98,47.96 98.96,47.96 99.21,47.7 99.21,45.06 97.74,43.59 97.74,42.72
  pour Route2 (rank 2): 0,0 0,59.69 113.03,59.69 113.03,0
  pour Route15: 0,0 0,59.69 113.03,59.69 113.03,0
  pour Bottom: 0,0 0,59.69 113.03,59.69 113.03,0
  cutout Route2: 49.15,48.46 49.15,59.69 85.17,59.69 85.17,48.46
  cutout Route15: 49.15,48.46 49.15,59.69 85.17,59.69 85.17,48.46
  cutout Bottom: 49.15,48.46 49.15,59.69 85.17,59.69 85.17,48.46
  pour Top (no thermals): 58.37,32.66 58.37,46.99 75.84,46.99 75.84,32.66
  pour Top: 111.76,34.54 111.76,25.4 107.54,25.4 107.19,25.76 107.19,34.34 107.39,34.54
  cutout Route2 (no thermals): 101.3,45.21 101.3,46.23 arc-90 102.31,47.24 arc-90 103.28,46.28 103.28,45.21 103.28,44.25 arc-90 102.26,43.23 arc-90 101.3,44.2
  cutout Route15 (no thermals): 101.3,44.2 101.3,46.23 arc-90 102.31,47.24 arc-90 103.28,46.28 103.28,44.25 arc-90 102.26,43.23 arc-90
LDO_VIN  (via drill 0.3)
  Top 0.203: U2.4 94.84,43.18 v94.84,44.15 | v100.18,42.62 100.28,42.52 R13.1
  Bottom 0.203: v94.84,44.15 98.65,44.15 v100.18,42.62
  pour Top (rank 2, no thermals): 94.18,42.88 95.66,42.88 95.66,44.4 96.47,44.4 96.47,47.96 96.82,48.31 98.5,48.31 98.5,54.31 94.95,54.31 94.69,54.05 94.69,44.91 94.18,44.4
LDO_VOUT
  Top 1.27: JP1.1 | JP1.1 95.56,31.45 R7.1
  pour Top (no thermals): 94.18,30.94 94.18,40.28 94.23,40.34 95.5,40.34 95.61,40.23 95.61,38.76 96.37,38.76 96.47,38.66 96.47,30.84 96.37,30.73 94.39,30.73
N$17
  Top 0.61: D1.C CONN1.1
N$18
  Top 0.61: R6.1 D1.A
N$28
  Top 0.203: LED2.C 110.49,38.76 109.63,39.62 107.14,39.62 106.22,38.71 SJ1.2
N$29
  Top 0.61: D3.ANODE 108.46,52.78 112.56,48.68 112.56,25.39 111.76,24.59 F1.2
N$31
  Top 0.203: LED2.A 108.96,37.15 R8.2
P2_12
  Top 0.203: JP2.7 63.5,8.89 63.5,17.63 61.34,19.79 57.83,19.79 56.24,21.39 56.24,35.05 57,35.82 U1.12
P2_23  (via drill 0.35)
  Top 0.203: U1.23 66.15,31 63.86,28.7 63.86,20.93 66.04,18.75 66.04,14.78 67.59,13.23 v67.61,13.23 68.58,12.27 68.58,8.89 JP2.9 | MS1.8 24.13,25.15 22.86,26.42 22.86,30.48 MS2.8
  Bottom 0.203: MS1.8 29.46,12.95 67.34,12.95 v67.61,13.23
P2_29_RGB_R  (via drill 0.3)
  Top 0.203: R3.1 68.59,25.64 v69.6,24.64 69.6,16.31 73.46,12.45 73.46,8.69 JP2.13 72.03,7.62 | U1.29 72.15,33.09 v72.19,33.12
  Bottom 0.203: v72.19,33.12 70.94,31.88 70.94,30.3 68,27.36 66.47,27.36 66.09,26.98 66.09,25.91 66.55,25.45 68.78,25.45 v69.6,24.64
P2_30  (via drill 0.3)
  Top 0.203: v78.59,14.28 v78.59,19.61 78.59,25.91 76.1,28.4 75.39,28.4 73.15,30.63 U1.30
  Bottom 0.203: MS2.25 24.13,34.64 25.4,33.37 25.4,30.83 24.13,29.56 MS1.25 32.21,19.86 78.33,19.86 v78.59,19.61 | JP2.15 76.2,8.89 76.2,11.89 v78.59,14.28
P2_31_RGB_B  (via drill 0.3)
  Top 0.203: JP2.17 77.47,7.01 76.1,5.64 72.08,5.64 71.12,6.6 71.12,11.18 66.65,15.65 66.65,19.3 65.63,20.32 64.47,21.49 64.47,24.68 R2.1 v65.43,27.53 | v74.12,33.27 74.15,33.24 U1.31
  Bottom 0.203: v74.12,33.27 73.05,33.27 72.03,34.29 71.02,34.29 70,33.27 70,30.43 67.41,27.84 65.73,27.84 v65.43,27.53
P2_32_RGB_G  (via drill 0.3)
  Top 0.203: JP2.19 78.74,8.89 78.74,11.38 77.62,12.5 74.62,12.5 70.21,16.92 70.21,25.3 69.04,26.47 67,26.47 66.95,26.42 R1.1 v66.95,26.62 | v75.13,30.79 75.13,31.95 U1.32
  Bottom 0.203: v75.13,30.79 72.59,30.79 68.43,26.62 v66.95,26.62
P2_33
  Top 0.203: JP2.21 81.28,8.89 81.28,11.58 79.35,13.51 79.35,26.26 76.55,29.06 U1.33
P2_35  (via drill 0.3)
  Top 0.203: JP2.25 86.36,8.89 86.36,10.82 85.19,11.99 82.5,11.99 80.72,13.77 v80.72,25.15 80.72,34.09 79.96,34.85 76.58,34.85 U1.35 | J1.4 v6.35,40.41 35.13,40.41 46.02,51.31 46.02,52.98 45.52,53.49 43.33,53.49 MS2.18 | J2.1 11.12,14.78 13.92,17.58 13.92,23.57 7.98,29.52 v5.33,29.52
  Bottom 0.203: MS2.18 41.91,34.53 43.18,33.27 43.18,30.83 41.91,29.56 MS1.18 46.79,23.06 78.64,23.06 v80.72,25.15 | v5.33,29.52 4.98,29.87 4.98,32.82 6.35,34.19 v6.35,40.41
P2_36  (via drill 0.3)
  Top 0.203: JP2.27 90.17,7.63 88.85,8.96 88.85,11.12 87.53,12.45 82.91,12.45 81.68,13.67 v81.68,26.11 81.68,34.04 79.9,35.82 U1.36 | J1.3 v7.62,41.41 33.79,41.41 MS2.17 | J2.2 11.14,16.78 13.01,18.64 13.01,23.37 v7.62,28.75
  Bottom 0.203: MS2.17 44.45,34.64 45.85,33.24 45.85,30.77 44.45,29.37 MS1.17 45.21,28.7 51.21,28.7 56.39,23.52 77.22,23.52 79.81,26.11 v81.68,26.11 | v7.62,28.75 v7.62,41.41
P2_40
  Top 0.203: JP2.29 92.75,7.62 93.78,8.65 93.78,13.05 87.99,18.84 87.99,24.64 87.99,31.9 80.07,39.82 U1.40 | MS1.12 34.29,25.15 33.02,26.42 33.02,30.48 MS2.12
  Bottom 0.203: MS1.12 35.81,9.14 37.34,9.14 38.1,8.38 38.1,6.86 39.12,5.84 90.93,5.84 JP2.29
P2_41
  Top 0.203: U1.41 80.24,40.82 88.65,32.41 88.65,24.03 88.65,18.9 94.13,13.41 94.13,8.74 JP2.31 | MS1.13 36.83,25.15 35.56,26.42 35.56,30.48 MS2.13
  Bottom 0.203: MS1.13 36.83,6.35 38.1,5.08 92.71,5.08 JP2.31
P2_42
  Top 0.203: U1.42 76.6,41.77 81.37,41.77 90.07,33.07 90.07,19.2 96.52,12.75 96.52,8.89 JP2.33 | MS1.11 31.75,25.15 30.48,26.42 30.48,30.48 MS2.11
  Bottom 0.203: MS1.11 35.05,4.32 94.49,4.32 JP2.33
P2_43  (via drill 0.3)
  Top 0.203: MS1.6 19.05,25.05 17.78,26.32 17.78,30.48 MS2.6 | JP2.35 99.06,8.89 99.06,12.29 v93.14,18.21 91.39,19.96 91.39,33.98 82.45,42.92 76.66,42.92 U1.43
  Bottom 0.203: MS1.6 25.35,13.92 66.22,13.92 67.31,15.01 76.43,15.01 77.44,16.03 87.43,16.03 89.61,18.21 v93.14,18.21
P2_44
  Top 0.203: JP2.37 102.87,8.18 101.6,9.45 101.6,10.72 92.05,20.27 92.05,34.34 83.01,43.38 77.98,43.38 77.54,43.82 U1.44 | MS1.10 29.21,25.15 27.94,26.42 27.94,30.48 MS2.10
  Bottom 0.203: MS1.10 33.27,3.56 98.81,3.56 JP2.37
P2_45  (via drill 0.35)
  Top 0.203: U1.45 77.42,44.82 78.35,43.89 83.62,43.89 92.81,34.7 92.81,25.4 | 92.81,25.4 92.81,20.47 102.87,10.41 JP2.38 | v92.79,25.4 92.81,25.4
  Bottom 0.203: MS2.19 39.37,34.54 40.64,33.27 40.64,29.21 MS1.19 44.7,22.61 79.5,22.61 82.3,25.4 v92.79,25.4
P2_47  (via drill 0.3)
  Top 0.203: MS1.9 26.67,25.05 25.4,26.32 25.4,30.48 MS2.9 | JP2.34 97.79,12.5 v93.55,16.74 90.73,19.56 90.73,33.43 81.99,42.16 v81.99,42.22 | U1.47 77.49,46.82 79.38,44.93 81.76,44.93 v81.94,45.11
  Bottom 0.203: MS1.9 31.55,12.5 68.02,12.5 69.49,13.97 77.06,13.97 78.23,15.14 91.95,15.14 v93.55,16.74 | v81.99,42.22 81.94,42.27 v81.94,45.11
P2_48  (via drill 0.3)
  Top 0.203: JP2.32 95.25,13.16 89.36,19.05 89.36,32.72 v81.23,40.84 | U1.48 77.98,47.67 v80.06,45.59
  Bottom 0.203: v80.06,45.59 80.06,42.01 v81.23,40.84
P2_49  (via drill 0.3)
  Top 0.203: MS1.7 21.59,25.05 20.32,26.32 20.32,30.48 MS2.7 | U1.49 74.15,46.4 v74.98,45.56 | JP2.30 92.71,13.01 v89.71,16 87.07,18.64 v87.07,29.77
  Bottom 0.203: v87.07,29.77 87.07,33.88 75.9,45.06 75.49,45.06 v74.98,45.56 | MS1.7 27.41,13.44 66.62,13.44 67.73,14.54 76.77,14.54 77.83,15.6 89.31,15.6 v89.71,16
P2_50  (via drill 0.3)
  Top 0.203: MS1.5 16.51,25.05 15.24,26.32 15.24,30.48 MS2.5 | U1.50 73.15,46.18 v73.76,45.57 | JP2.28 90.17,13.26 86.77,16.66 | 86.77,16.66 86.31,17.12 v86.31,31.03 v86.31,31.04 | v86.87,16.66 86.77,16.66
  Bottom 0.203: v73.76,45.57 74.75,44.58 75.56,44.58 86.26,33.88 86.26,31.09 v86.31,31.04 | MS1.5 23.29,14.4 65.81,14.4 66.86,15.46 76.11,15.46 77.27,16.61 86.82,16.61 v86.87,16.66
P2_51  (via drill 0.3, 0.35)
  Top 0.203: U1.51 72.15,45.96 v72.54,45.57 | v85.61,29.77 85.6,29.76 v85.6,24.64 85.6,14.63 v86.41,13.82
  Bottom 0.203: JP2.26 87.63,12.6 v86.41,13.82 | v72.54,45.57 74.02,44.09 75.49,44.09 85.61,33.98 v85.61,29.77 | MS2.20 36.83,34.54 38.1,33.27 38.1,29.21 MS1.20 36.88,27.94 42.67,22.15 79.91,22.15 82.4,24.64 v85.6,24.64
P2_52  (via drill 0.3, 0.35)
  Top 0.203: U1.52 71.15,45.69 v71.27,45.57 | v84.78,31.04 v84.78,23.5 84.78,14.17 v85.14,13.82
  Bottom 0.203: v85.14,13.82 85.14,10.21 JP2.24 | v71.27,45.57 73.23,43.61 75.26,43.61 84.78,34.09 v84.78,31.04 | MS2.21 34.29,34.54 35.56,33.27 35.56,29.21 MS1.21 35.21,27.94 41.46,21.69 80.36,21.69 82.16,23.5 v84.78,23.5
P2_53  (via drill 0.3, 0.35)
  Top 0.203: U1.53 70.15,45.66 v70.05,45.57 | v83.97,29.77 83.92,29.72 v83.92,22.35 v83.92,14.22
  Bottom 0.203: JP2.22 83.92,11.53 v83.92,14.22 | v70.05,45.57 72.49,43.13 75.03,43.13 83.92,34.24 83.92,29.82 v83.97,29.77 | MS2.22 31.75,34.54 33.02,33.27 33.02,29.21 MS1.22 38.46,21.23 80.77,21.23 81.89,22.35 v83.92,22.35
P2_54  (via drill 0.3, 0.35)
  Top 0.203: v68.83,45.57 69.15,45.88 U1.54 | v83.11,31.04 v83.11,20.32 v83.11,13.31 83.41,13.01 88.85,13.01 v89.05,13.21 | CONN1.2 109.42,21.59 108.81,20.98 v108.81,15.19
  Bottom 0.203: JP2.20 80.01,10.21 v83.11,13.31 | v68.83,45.57 71.81,42.6 74.8,42.6 83.11,34.29 v83.11,31.04 | v89.05,13.21 89.15,13.31 106.93,13.31 v108.81,15.19 TP8.TP | MS2.24 26.67,34.54 27.94,33.27 27.94,29.21 MS1.24 34.29,20.32 v83.11,20.32
P2_55  (via drill 0.3)
  Top 0.203: v67.61,45.57 68.15,46.1 U1.55 | v82.35,29.77 v82.35,21.39 82.35,14.43 v82.3,14.38
  Top 0.61: v109.68,20.32 CONN1.4
  Bottom 0.203: MS2.23 29.21,34.64 30.48,33.37 30.48,30.83 29.21,29.56 MS1.23 36.37,20.78 81.74,20.78 v82.35,21.39 84.94,21.39 87.48,23.93 97.38,23.93 99.47,21.84 106.17,21.84 107.59,23.27 TP7.TP 109.68,22.4 v109.68,20.32 | JP2.18 78.08,10.16 v82.3,14.38 | v67.61,45.57 71.09,42.09 74.6,42.09 82.35,34.34 v82.35,29.77
P2_63  (via drill 0.3)
  Top 0.203: MS1.14 39.37,25.05 38.1,26.32 38.1,30.48 MS2.14 46.74,39.12 54.41,39.12 55.02,38.51 v55.02,37.54 | 60.25,47.57 U1.63 60.14,46.33 v60.35,46.13
  Bottom 0.203: MS1.14 43.74,11.99 68.02,11.99 JP2.12 | v55.02,37.54 55.42,37.54 60.35,42.46 v60.35,46.13
P2_64  (via drill 0.3)
  Top 0.203: MS1.15 41.91,25.05 40.64,26.32 40.64,30.48 MS2.15 48.46,38.3 v53.7,38.3 | v59.69,45.36 59.69,46.33 59.15,46.87 U1.64
  Bottom 0.203: MS1.15 45.82,11.53 65.89,11.53 67.26,10.16 JP2.10 | v59.69,45.36 59.69,42.52 55.47,38.3 v53.7,38.3
P2_USB_N  (via drill 0.3)
  Top 0.203: USB.2 108.03,29.17
  Top 0.483: U1.62 61.15,46.87 61.33,46.68 61.33,44.86 61.97,44.22 64.23,44.22 v64.36,44.08 | v101.45,33.98 101.59,33.85 101.59,29.86 102.36,29.08 102.67,29.08 103.12,28.63 103.17,28.68 | D2.4 103.19,28.66 103.17,28.68 | 108.03,29.17 103.67,29.17 103.17,28.68
  Bottom 0.483: v64.36,44.08 64.47,44.19 65.35,44.19 66.52,45.35 66.52,46.2 67.21,46.89 91.78,46.89 93.77,48.88 102.15,48.88 104.55,46.48 104.55,40.89 101.58,37.93 101.58,34.11 v101.45,33.98
P2_USB_P  (via drill 0.3)
  Top 0.406: 105.09,30.24 104.65,29.79 102.69,29.79
  Top 0.483: U1.61 62.15,46.87 61.97,46.68 61.97,45.12 62.23,44.86 64.23,44.86 v64.36,44.99 | v102.36,33.98 102.22,33.85 102.22,30.26 102.69,29.79 | USB.3 105.92,29.84 105.09,30.67 D2.1 105.09,30.24
  Bottom 0.483: v64.36,44.99 64.49,44.87 65.14,44.87 65.89,45.62 65.89,46.47 66.94,47.52 91.52,47.52 93.32,49.33 | 93.32,49.33 | 93.32,49.33 93.51,49.51 102.41,49.51 102.6,49.33 | 102.6,49.33 | 102.6,49.33 105,46.93 | 105,46.93 | 105,46.93 105.18,46.74 105.18,40.63 105,40.45 | 105,40.45 | v102.36,33.98 102.23,34.11 102.23,37.69 105,40.45
RGB_B
  Top 0.203: R2.2 65.23,24.14 65.23,21.64 65.47,21.4 LED1.BLUE
RGB_G
  Top 0.203: R1.2 66.95,23.77 66.2,23.02 LED1.GREEN
RGB_R
  Top 0.203: R3.2 68.48,23.27 LED1.RED
VBUS  (via drill 0.3)
  Top 0.254: USB.1 108,28.49
  Top 0.483: 103.12,26.57 102.72,26.16 F1.1 99.87,24.59 98.86,23.57
  Top 0.508: v57.15,16.56 JP2.2 | 108,28.49 106.83,28.49 106.17,27.84 106.17,27.38 105.82,27.03 104.75,27.03 104.14,27.64 D2.5 104.14,27.58 103.12,26.57 | v98.86,20.42 98.86,23.57
  Bottom 0.203: 21.59,51.82 MS2.26 | 22.68,30.66 22.73,30.7
  Bottom 0.406: MS1.26 21.59,29.56 22.68,30.66 22.84,30.81 22.84,33.39 21.59,34.64 21.59,51.82
  Bottom 0.508: MS1.26 32.97,16.56 v57.15,16.56 75.23,16.56 76.71,18.03 87.58,18.03 89.97,20.42 v98.86,20.42
VIN
  Top 0.61: JP2.1 57.15,5.59 59.44,3.3 104.14,3.3 107.75,6.91 107.75,10.57 105.92,12.39 104.6,12.39 97.79,19.2 97.79,25.4 100.28,27.89 100.28,32.82 99.67,33.43 99.67,34.9 102.28,37.51 J3.PWR
  pour Top (no thermals): 99.01,48.67 99.42,48.67 101.09,46.99 101.09,43.89 101.75,43.23 102.82,43.23 103.43,43.84 103.43,47.6 100.23,50.8 99.01,50.8

### Text on the board
tPlace: WKP | SWIO | SCLK | SCK1 | 5VDC | + | NC | EN | VBUS | D10/ | D7/ | D6/ | D5/SS1 | D4/ | D3/MI1 | D2/MO1 | D1/SCL | D0/SDA | D3 | D6 | GND | 3V3 | D0/SDA | D1/SCL | P2 EVAL BOARD | v1.0.0 | U2 | MARCH 2022 | 3V3 | !RST/34 | 3V3 | MODE/46 | GND | A0/50 | A1/43 | A2/49 | A5 | S4/47 | S3/SS/44 | S2/SCK/42 | S0/MO/40 | S1/MI/41 | D9/RX/63 | D8/TX/64 | NC | NC | EN | VBUS | D10/WKP/30 | D7/SWDIO/54 | D6/SWCLK/55 | D5/SS1/53 | D4/SCK1/52 | D3/MI1/51 | D2/MO1/45 | D1/SCL/35 | D0/SDA/36 | GND | RESET | LED1 | MODE | 3V3 | D0/SDA | D1/SCL | SWD | VBUS | GND | 3V3 | ENABLE | D8/TX/64 | D9/RX/63 | GND | NC | D6/SWCLK/55 | D7/SWDIO/54 | D5/SS1/53 | D4/SCK1/52 | D3/MI1/51 | A0/50 | A2/49 | S5/48 | S4/47 | !MODE!/46 | D2/MO1/45 | GND | !RST | 3V3 | MODE | GND | A0 | A1 | A2 | A5 | S4 | S3/SS | S2/SCK | S0/MO | S1/MI | D9/RX | D8/TX | NC | VIN | GND | 3V3 | V_M/12 | A5/23 | NC | RED/29 | D10/30 | BLU/31 | GRN/32 | S6/33 | !RST!/34 | D1/SCL | D0/SDA | S0/MO | S1/MI | S2/SCK | A1/43 | S3/SS | GND
Document: DIELECTRIC = 3.61 at 1GHz / / TOP LAYER = 1.7MIL (1 OZ) / PREPEG = 7.96MIL / LAYER 2 = 0.68MIL (0.5 OZ) / CORE = 47MIL / LAYER 3 = 0.68MIL (0.5 OZ) / PREPEG = 7.96MIL / BOTTOM LAYER = 1.7MIL (1 OZ)